# EAGLE design Volty (EAGLE 6.6.0)
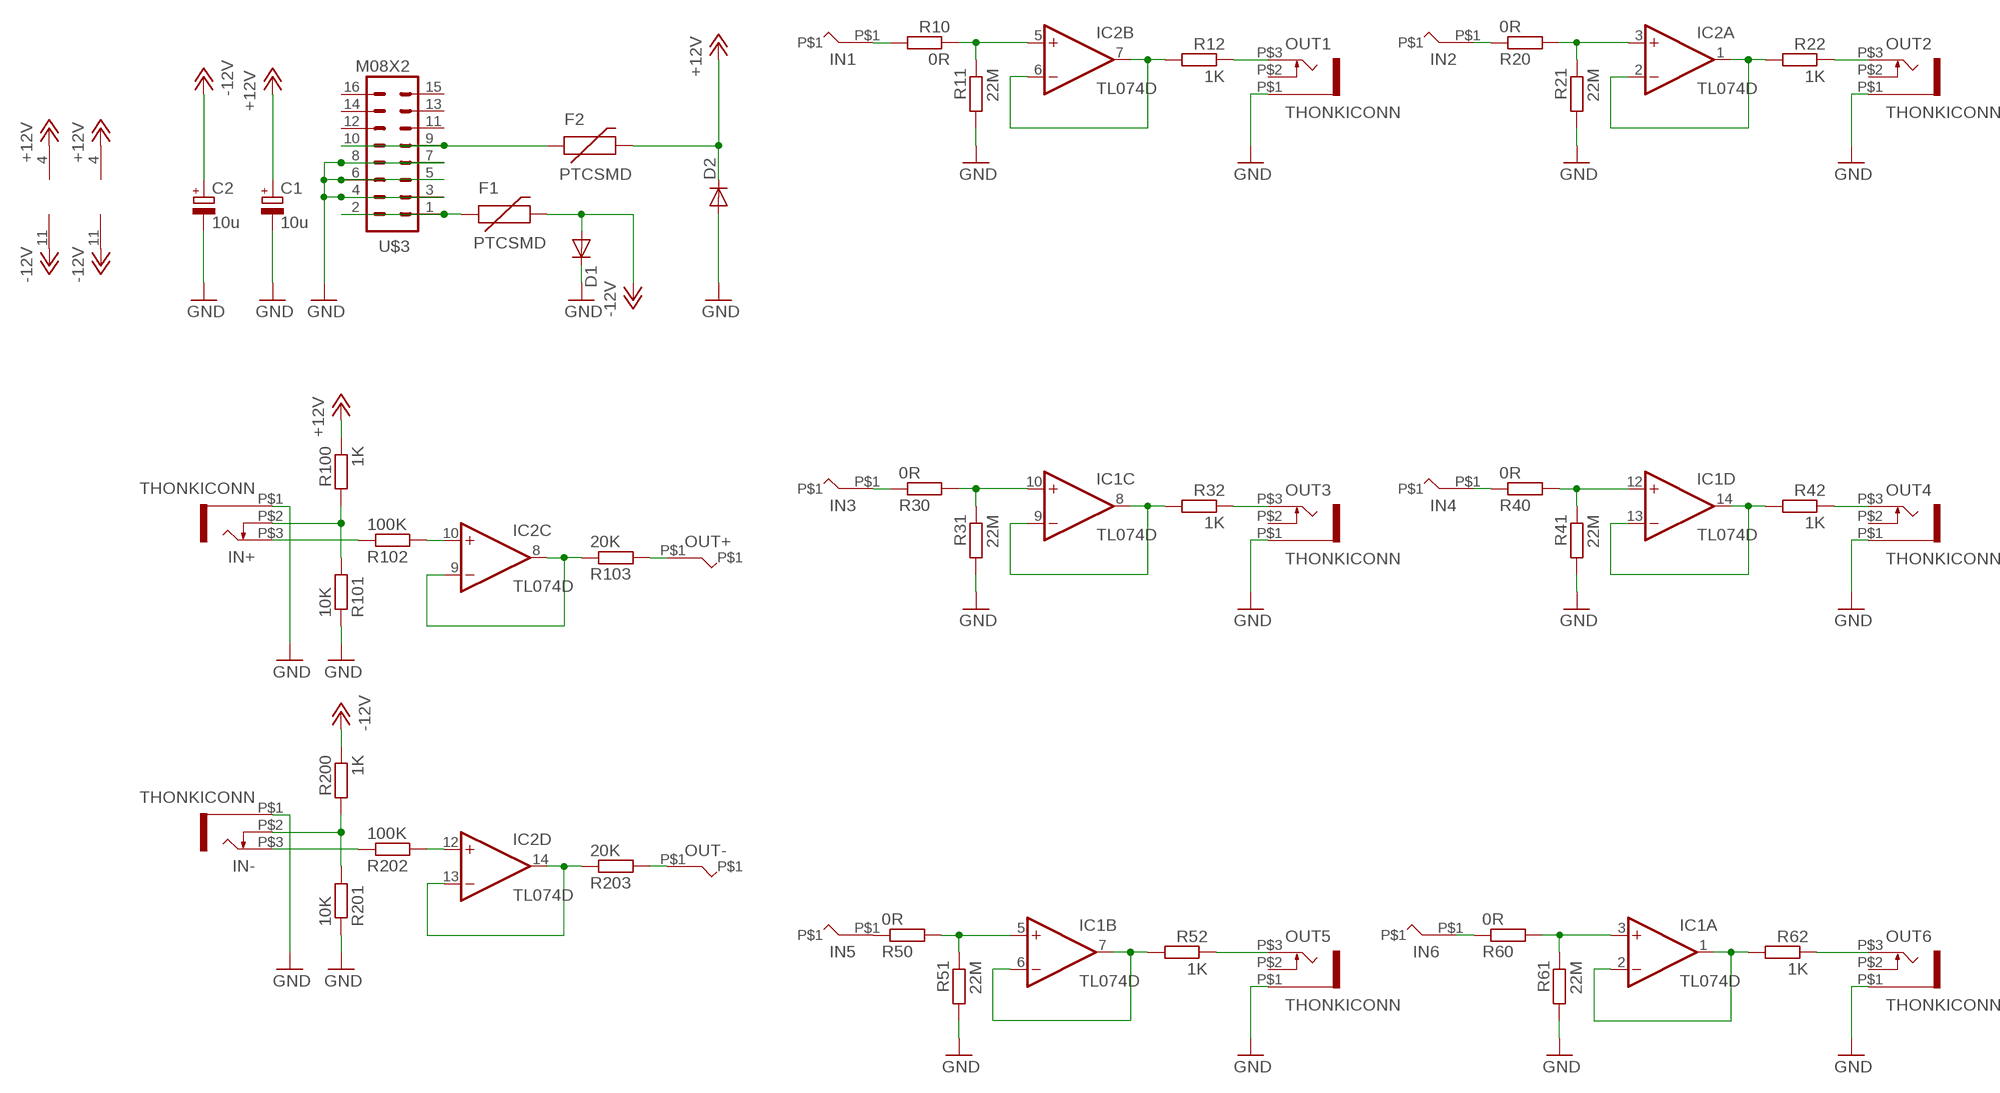
[diagram p0: schematic, sheet 1]

## Parts
C1  10u  CPOL-EUE2.5-6  [E2,5-6]
C2  10u  CPOL-EUE2.5-6  [E2,5-6]
D1  DIODESMA  [SMA-DIODE]
D2  DIODESMA  [SMA-DIODE]
F1  PTCSMD  [PTC-1206]
F2  PTCSMD  [PTC-1206]
IC1  TL074D  [SO14]
IC2  TL074D  [SO14]
IN1  BANANAJACK  [BANANAJACK]
IN2  BANANAJACK  [BANANAJACK]
IN3  BANANAJACK  [BANANAJACK]
IN4  BANANAJACK  [BANANAJACK]
IN5  BANANAJACK  [BANANAJACK]
IN6  BANANAJACK  [BANANAJACK]
IN+  THONKICONN  [THONKICONN]
IN-  THONKICONN  [THONKICONN]
OUT1  THONKICONN  [THONKICONN]
OUT2  THONKICONN  [THONKICONN]
OUT3  THONKICONN  [THONKICONN]
OUT4  THONKICONN  [THONKICONN]
OUT5  THONKICONN  [THONKICONN]
OUT6  THONKICONN  [THONKICONN]
OUT+  BANANAJACK  [BANANAJACK]
OUT-  BANANAJACK  [BANANAJACK]
R10  0R  R-EU_0603  [0603]
R11  22M  R-EU_0603  [0603]
R12  1K  R-EU_0603  [0603]
R20  0R  R-EU_0603  [0603]
R21  22M  R-EU_0603  [0603]
R22  1K  R-EU_0603  [0603]
R30  0R  R-EU_0603  [0603]
R31  22M  R-EU_0603  [0603]
R32  1K  R-EU_0603  [0603]
R40  0R  R-EU_0603  [0603]
R41  22M  R-EU_0603  [0603]
R42  1K  R-EU_0603  [0603]
R50  0R  R-EU_0603  [0603]
R51  22M  R-EU_0603  [0603]
R52  1K  R-EU_0603  [0603]
R60  0R  R-EU_0603  [0603]
R61  22M  R-EU_0603  [0603]
R62  1K  R-EU_0603  [0603]
R100  1K  R-EU_0603  [0603]
R101  10K  R-EU_0603  [0603]
R102  100K  R-EU_0603  [0603]
R103  20K  R-EU_0603  [0603]
R200  1K  R-EU_0603  [0603]
R201  10K  R-EU_0603  [0603]
R202  100K  R-EU_0603  [0603]
R203  20K  R-EU_0603  [0603]
U$3  M08X2  [2X8]

## Nets
+12V: C1.+ D2.C F2.2 IC1.4(P:V+) IC2.4(P:V+) R100.1
-12V: C2.+ D1.A F1.2 IC1.11(P:V-) IC2.11(P:V-) R200.1
GND: C1.- C2.- D1.C D2.A IN+.P$1 IN-.P$1 OUT1.P$1 OUT2.P$1 OUT3.P$1 OUT4.P$1 OUT5.P$1 OUT6.P$1 R11.2 R21.2 R31.2 R41.2 R51.2 R61.2 R101.1 R201.1 U$3.3 U$3.4 U$3.5 U$3.6 U$3.7 U$3.8
N$1: IN6.P$1 R60.1
N$3: IN2.P$1 R20.1
N$4: IC2.10(C:+IN) R102.2
N$5: IN+.P$2 R100.2 R101.2
N$6: F1.1 U$3.1 U$3.2
N$7: F2.1 U$3.9 U$3.10
N$8: IN1.P$1 R10.2
N$9: IN3.P$1 R30.1
N$10: IC2.6(B:-IN) IC2.7(B:OUT) R12.2
N$11: OUT1.P$3 R12.1
N$12: IN5.P$1 R50.1
N$13: IC2.5(B:+IN) R10.1 R11.1
N$14: IN+.P$3 R102.1
N$15: OUT+.P$1 R103.2
N$16: IC2.8(C:OUT) IC2.9(C:-IN) R103.1
N$17: OUT-.P$1 R203.2
N$18: IC2.13(D:-IN) IC2.14(D:OUT) R203.1
N$19: IN4.P$1 R40.1
N$20: IC2.12(D:+IN) R202.2
N$21: IN-.P$3 R202.1
N$22: IN-.P$2 R200.2 R201.2
N$23: IC2.3(A:+IN) R20.2 R21.1
N$24: IC1.3(A:+IN) R60.2 R61.1
N$25: IC1.12(D:+IN) R40.2 R41.1
N$26: OUT3.P$3 R32.1
N$27: OUT5.P$3 R52.1
N$28: IC1.8(C:OUT) IC1.9(C:-IN) R32.2
N$29: IC1.6(B:-IN) IC1.7(B:OUT) R52.2
N$30: IC1.5(B:+IN) R50.2 R51.1
N$31: OUT4.P$3 R42.1
N$32: OUT6.P$3 R62.1
N$33: OUT2.P$3 R22.1
N$34: IC2.1(A:OUT) IC2.2(A:-IN) R22.2
N$35: IC1.13(D:-IN) IC1.14(D:OUT) R42.2
N$36: IC1.1(A:OUT) IC1.2(A:-IN) R62.2
N$37: IC1.10(C:+IN) R30.2 R31.1
Unconnected: OUT1.P$2 OUT2.P$2 OUT3.P$2 OUT4.P$2 OUT5.P$2 OUT6.P$2 U$3.11 U$3.12 U$3.13 U$3.14 U$3.15 U$3.16

## Library data of the parts
C1 C2 = resistor:CPOL-EU: POLARIZED CAPACITOR, European symbol
D1 D2 = SparkFun:DIODE: Diode These are standard reverse protection diodes and small signal diodes. SMA package can handle up to about 1A. SOD-323 can handle about 200mA. What the SOD-323 package when ordering, there are some mfgs out there that are 5-pin packages.
F1 F2 = SparkFun:PTC: Resettable Fuse PTC Resettable Fuse. Spark Fun Electronics SKU : COM-08357
IC1 IC2 = linear:TL074: OP AMP
IN1-IN6 OUT+ OUT- = Rebel:BANANAJACK
IN+ IN- OUT1-OUT6 = Rebel:THONKICONN
R10-R12 R20-R22 R30-R32 R40-R42 R50-R52 R60-R62 R100-R103 R200-R203 = Rebel:R-EU_: RESISTOR, European symbol
U$3 = SparkFun:M08X2

## Board
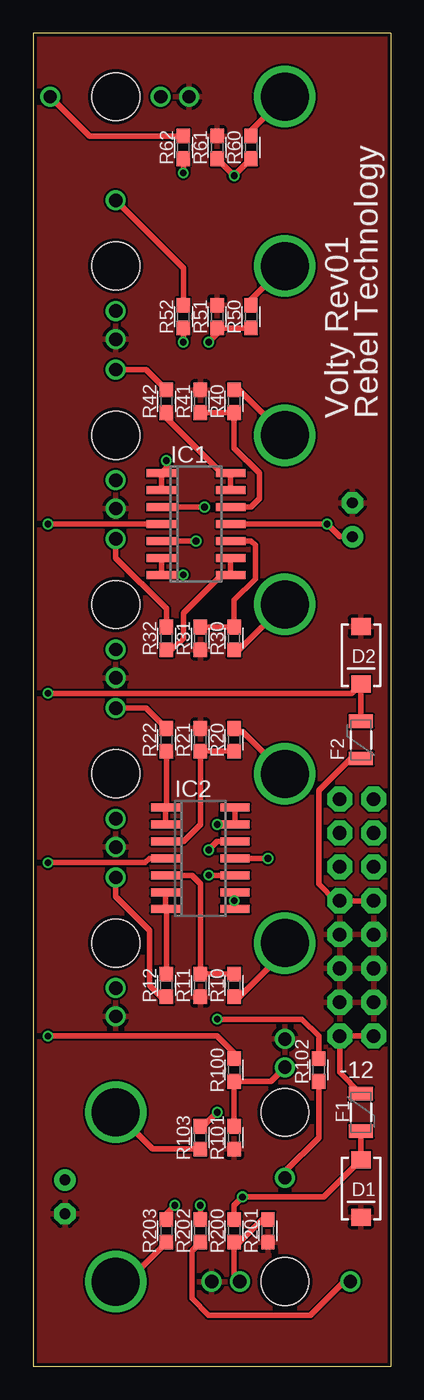
[diagram p1: board, top side]
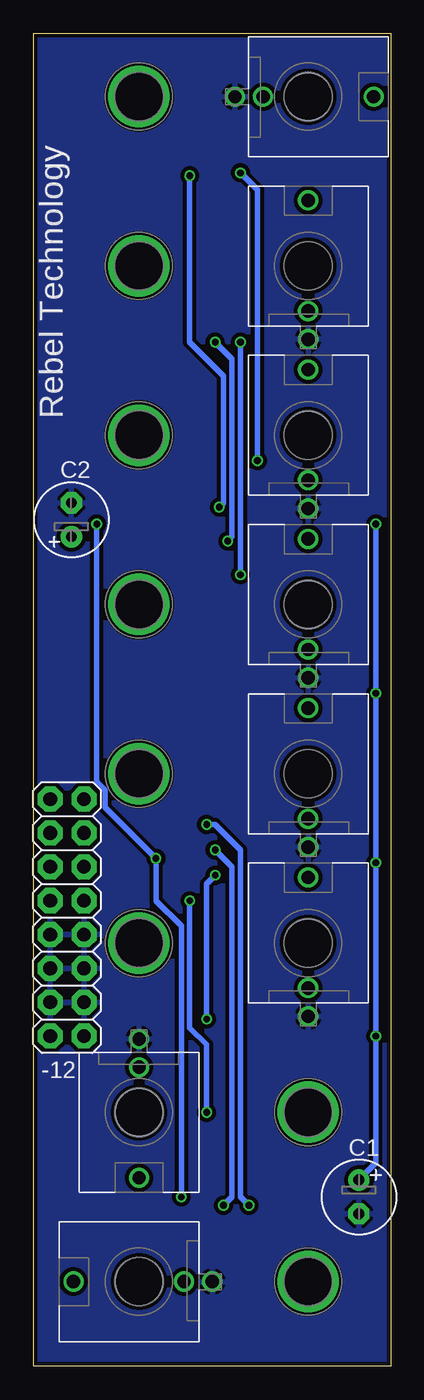
[diagram p2: board, bottom side, seen from below]

Size 26.82 x 100 mm. Coordinates in mm from the lower left corner, seen from the top.
Outline: 26.82,100 0,100 0,0 26.82,0 26.82,100
Copper layers (1*16): Top 0.035mm / dielectric 1.5mm / Bottom 0.035mm
Design rules "Fusion_eagle_rule_v1.1": minimum track width 6mil, minimum drill 12mil, track to track 6mil, track to pad 6mil, pad to pad 6mil, via to via 6mil, smd to smd 0mil, copper to edge 10mil, drill to drill 10mil, minimum pad ring 10mil, minimum via ring 6mil, stop-mask expansion 2mil, vias tented up to drill 100mil, thermal gap 10mil

### Footprints (pad centres in the part's own frame; a part is rotated, then mirrored left to right if it is on the bottom)
E2,5-6 = drill 0.813 pad 1.6: + -1.27,0 | drill 0.813 pad 1.6 octagon: - 1.27,0
SMA-DIODE = smd 1.27 x 1.47: A -2.15,0; C 2.15,0
PTC-1206 = smd 1 x 1.8: 1 -1.4,0; 2 1.4,0
SO14 = smd 0.6 x 2.2: 1 -3.81,-2.6; 2 -2.54,-2.6; 3 -1.27,-2.6; 4 0,-2.6; 5 1.27,-2.6; 6 2.54,-2.6; 7 3.81,-2.6; 8 3.81,2.6; 9 2.54,2.6; 10 1.27,2.6; 11 0,2.6; 12 -1.27,2.6; 13 -2.54,2.6; 14 -3.81,2.6
BANANAJACK = drill 3.6: P$1 0,0
THONKICONN = drill 1: P$1 0,-5.5; P$2 0,-3.38; P$3 0,4.92 | hole 3.6: 0,0
0603 = smd 1.1 x 1: 1 -0.85,0; 2 0.85,0
2X8 = drill 1.016 pad 1.88 octagon: 1 0,0; 2 0,2.54; 3 2.54,0; 4 2.54,2.54; 5 5.08,0; 6 5.08,2.54; 7 7.62,0; 8 7.62,2.54; 9 10.16,0; 10 10.16,2.54; 11 12.7,0; 12 12.7,2.54; 13 15.24,0; 14 15.24,2.54; 15 17.78,0; 16 17.78,2.54

### Placement (x,y rotation side)
C1  2.38,12.7 270 bottom
C2  23.97,63.5 90 bottom
D1  24.6,13.34 270 top
D2  24.6,53.34 270 top
F1  24.6,19.05 270 top
F2  24.6,46.99 90 top
IC1  12.22,63.18 270 top
IC2  12.54,38.1 270 top
IN1  18.89,31.75 0 bottom
IN2  18.89,44.45 0 bottom
IN3  18.89,57.15 0 bottom
IN4  18.89,69.85 0 bottom
IN5  18.89,82.55 0 bottom
IN6  18.89,95.25 0 bottom
IN+  18.89,19.05 180 bottom
IN-  18.89,6.35 90 bottom
OUT1  6.19,31.75 0 bottom
OUT2  6.19,44.45 0 bottom
OUT3  6.19,57.15 0 bottom
OUT4  6.19,69.85 0 bottom
OUT5  6.19,82.55 0 bottom
OUT6  6.19,95.25 270 bottom
OUT+  6.19,19.05 0 bottom
OUT-  6.19,6.35 0 bottom
R10  15.08,28.57 270 top
R11  12.54,28.57 270 top
R12  10,28.57 90 top
R20  15.08,46.99 270 top
R21  12.54,46.99 90 top
R22  10,46.99 270 top
R30  15.08,54.61 90 top
R31  12.54,54.61 270 top
R32  10,54.61 270 top
R40  15.08,72.39 270 top
R41  12.54,72.39 90 top
R42  10,72.39 270 top
R50  16.35,78.74 270 top
R51  13.81,78.74 90 top
R52  11.27,78.74 270 top
R60  16.35,91.44 270 top
R61  13.81,91.44 90 top
R62  11.27,91.44 270 top
R100  15.08,22.23 270 top
R101  15.08,17.14 90 top
R102  21.43,22.23 90 top
R103  12.54,17.14 270 top
R200  15.08,10.16 270 top
R201  17.62,10.16 90 top
R202  12.54,10.16 90 top
R203  10,10.16 270 top
U$3  23.02,24.77 90 bottom

### Tracks (layer width: path | path; a pad name or v marks a point on that pad's centre or on a via)
+12V  (via drill 0.5)
  Top 0.406: IC1.4 v1.11,63.18 | v1.11,37.78 8.41,37.78 8.73,38.1 IC2.4 | R100.1 15.08,23.5 13.81,24.77 v1.11,24.77 | F2.2 D2.C 23.89,50.48 v1.11,50.48
  Bottom 0.406: v1.11,63.18 v1.11,50.48 v1.11,37.78 v1.11,24.77 1.11,15.24 C1.+
-12V  (via drill 0.5)
  Top 0.406: IC1.11 v22.06,63.18 23.02,62.23 C2.+ | v17.62,38.1 IC2.11 | F1.2 D1.A 21.82,12.7 v15.71,12.7 15.08,12.06 R200.1
  Bottom 0.406: v22.06,63.18 22.06,43.81 21.43,43.18 21.43,41.91 v17.62,38.1 17.62,34.92 15.71,33.02 v15.71,12.7
GND
  pour Bottom (isolate 0.305): 27.78,0 -3.97,0 -3.97,100.33 27.78,100.33
  pour Top: -3.97,100.33 -3.97,0 27.78,0 27.78,100.33
N$1
  Top 0.406: R60.1 16.35,92.71 IN6.P$1
N$3
  Top 0.406: IN2.P$1 15.71,47.62 15.29,47.62 R20.1
N$4  (via drill 0.5)
  Top 0.406: R102.2 21.43,24.77 20.16,26.04 v13.81,26.04 | v13.17,36.83 IC2.10
  Bottom 0.406: v13.81,26.04 13.81,36.2 v13.17,36.83
N$5
  Top 0.406: R101.2 R100.2 17.83,21.38 IN+.P$2
N$6
  Top 0.406: F1.1 23.02,22.04 U$3.1 U$3.2
N$7
  Top 0.406: F2.1 24.1,45.59 23.97,45.72 21.43,43.18 21.43,36.2 22.7,34.92 U$3.9 U$3.10
N$8
  Top 0.406: R10.2 15.5,27.73 18.89,31.11 IN1.P$1
N$9
  Top 0.406: R30.1 15.5,53.76 IN3.P$1
N$10
  Top 0.406: R12.2 10,34.23 IC2.7 IC2.6
N$11
  Top 0.406: R12.1 9.58,27.73 8.73,28.57 8.73,32.7 6.19,35.24 OUT1.P$3
N$12
  Top 0.406: R50.1 16.35,80.01 IN5.P$1
N$13
  Top 0.406: R10.1 R11.1 12.54,36.2 11.9,36.83 IC2.5
N$14
  Top 0.406: IN+.P$3 18.89,14.61 21.43,17.14 R102.1
N$15
  Top 0.406: R103.2 8.94,16.3 OUT+.P$1
N$16  (via drill 0.5)
  Top 0.406: IC2.9 IC2.8 15.08,34.23 v15.08,34.92 | R103.1 12.75,18 v13.81,19.05
  Bottom 0.406: v13.81,19.05 13.81,24.13 15.08,25.4 v15.08,34.92
N$17
  Top 0.406: OUT-.P$1 7.04,6.35 R203.2
N$18  (via drill 0.5)
  Top 0.406: IC2.14 IC2.13 v13.81,40.64 | R203.1 10,11.43 v10.63,12.06
  Bottom 0.406: v13.81,40.64 13.17,40.64 11.27,38.73 11.27,12.7 v10.63,12.06
N$19
  Top 0.406: R40.1 15.5,73.24 IN4.P$1
N$20  (via drill 0.5)
  Top 0.406: IC2.12 13.81,39.37 v13.17,38.73 | v12.54,12.06 R202.2
  Bottom 0.406: v13.17,38.73 11.9,37.47 11.9,12.7 v12.54,12.06
N$21
  Top 0.406: IN-.P$3 23.33,6.35 20.79,3.81 13.17,3.81 11.9,5.08 11.9,8.68 R202.1
N$22
  Top 0.406: R201.2 17.2,11.01 15.5,9.31 R200.2 15.08,6.99 15.51,6.55 IN-.P$2
N$23
  Top 0.406: R20.2 R21.1 12.54,40.64 11.27,39.37 IC2.3
N$24  (via drill 0.5)
  Top 0.406: R61.1 v15.08,89.32 R60.2 | IC1.3 v12.86,64.45
  Bottom 0.406: v12.86,64.45 12.54,64.77 12.54,74.3 15.08,76.83 v15.08,89.32
N$25
  Top 0.406: IC1.12 16.35,64.45 16.98,65.09 16.98,66.99 15.08,68.9 R40.2 R41.1
N$26
  Top 0.406: R32.1 10,56.83 6.19,60.64 OUT3.P$3
N$27
  Top 0.406: R52.1 11.27,82.39 OUT5.P$3
N$28
  Top 0.406: R32.2 10.42,53.76 11.27,54.61 11.27,56.52 14.13,59.37 IC1.8 IC1.9
N$29  (via drill 0.5)
  Top 0.406: IC1.6 IC1.7 v11.27,59.37 | v11.27,76.83 R52.2
  Bottom 0.406: v11.27,59.37 v11.27,76.83
N$30  (via drill 0.5)
  Top 0.406: IC1.5 v12.22,61.91 | v13.17,76.83 13.81,77.47 R51.1 R50.2
  Bottom 0.406: v12.22,61.91 11.9,62.23 11.9,75.56 v13.17,76.83
N$31
  Top 0.406: OUT4.P$3 8.47,74.77 R42.1
N$32
  Top 0.406: R62.1 4.23,92.29 OUT6.P$3
N$33
  Top 0.406: OUT2.P$3 8.47,49.37 R22.1
N$34
  Top 0.406: R22.2 10,41.97 IC2.1 IC2.2
N$35
  Top 0.406: IC1.13 IC1.14 14.13,66.99 10,71.12 R42.2
N$36  (via drill 0.5)
  Top 0.406: IC1.2 IC1.1 10,67.37 v10,67.94 | v11.27,89.53 R62.2
  Bottom 0.406: v10,67.94 10,88.27 v11.27,89.53
N$37
  Top 0.406: R31.1 R30.2 15.08,57.47 16.66,59.05 16.66,61.59 16.35,61.91 IC1.10

### Text on the board
tPlace: Volty Rev01 | Rebel Technology | -12
bPlace: Rebel Technology | -12